# EAGLE design Z80 breakout board (EAGLE 5.06)
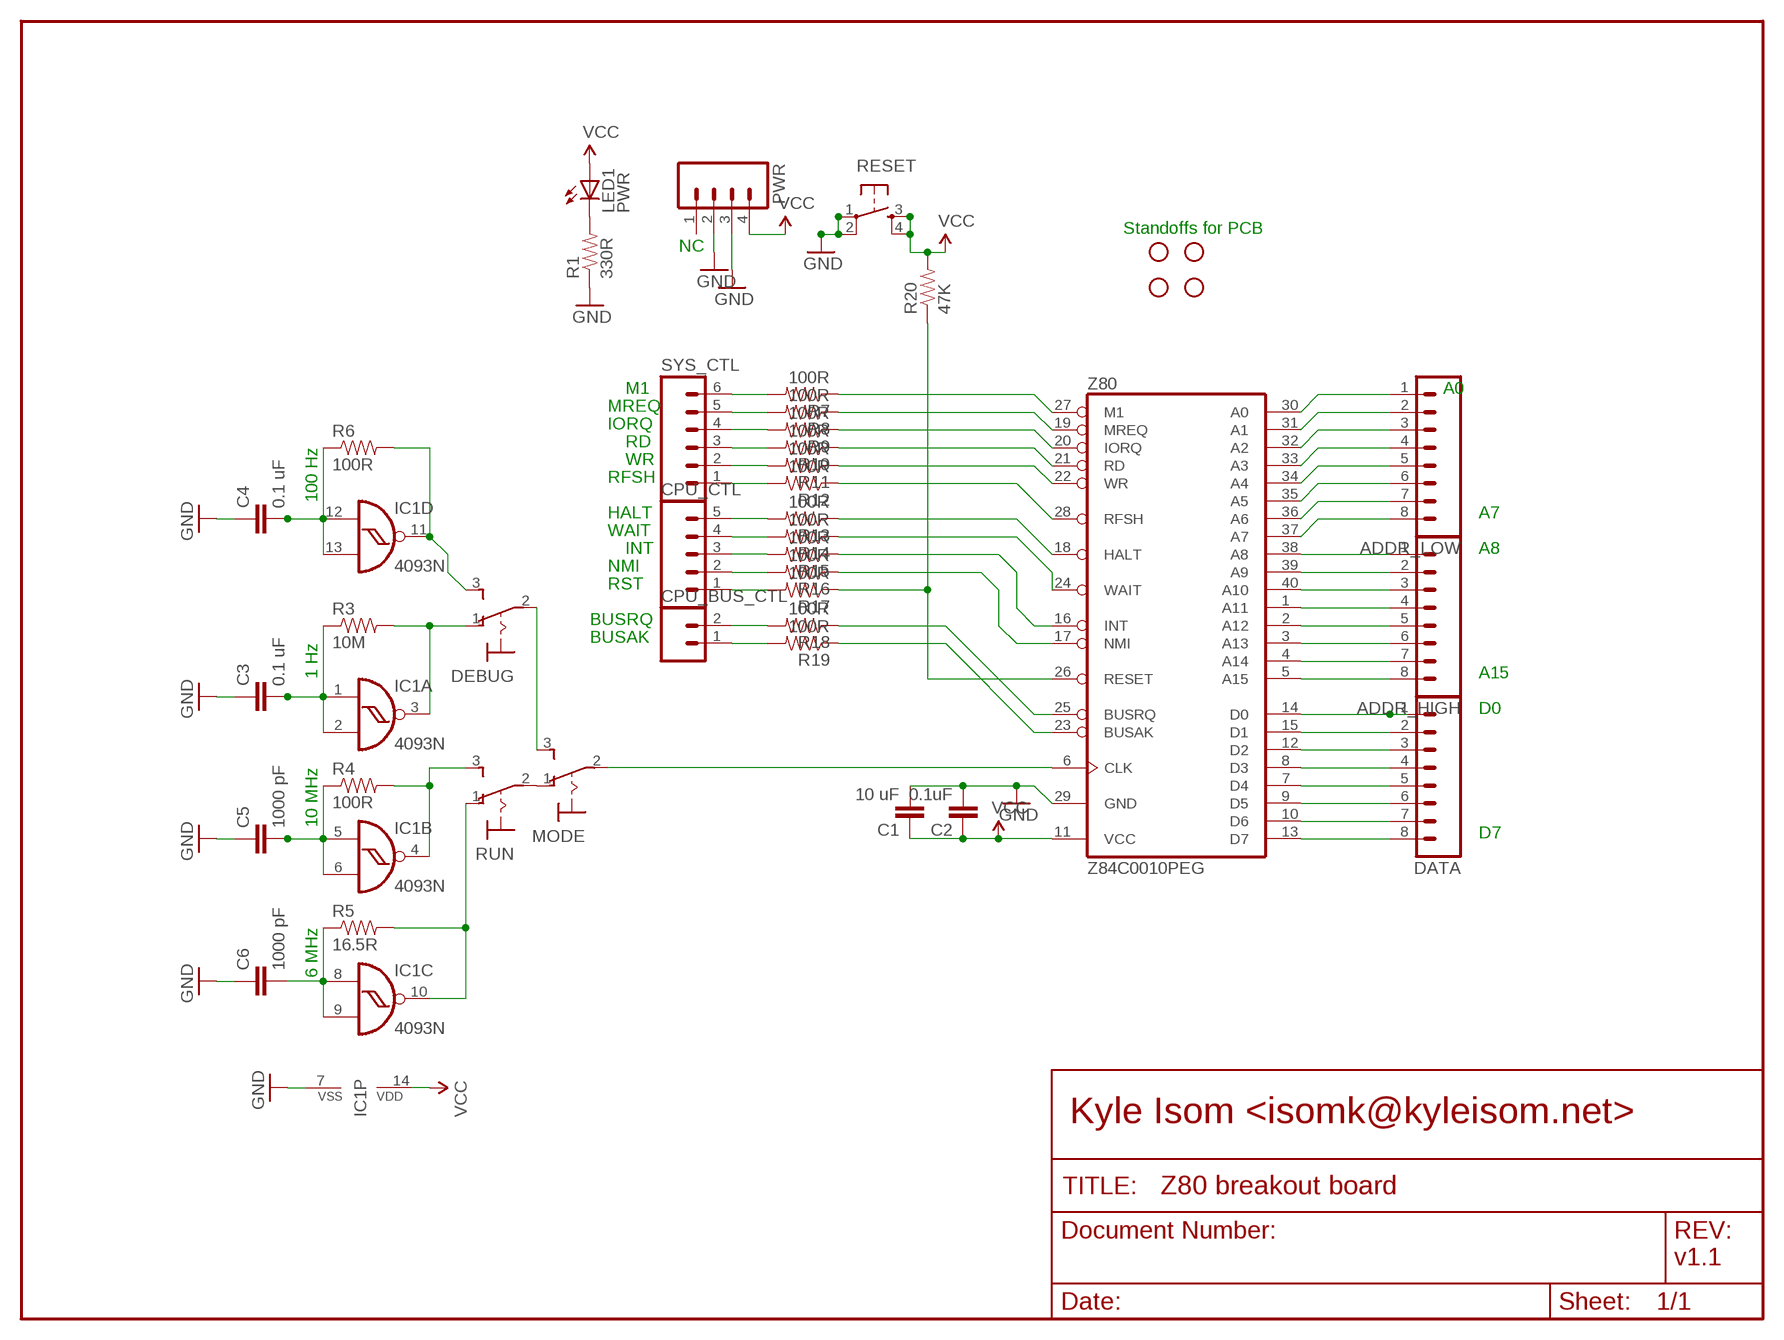
[diagram p0: schematic, sheet 1]

## Parts
ADDR_HIGH  M08  [1X08]
ADDR_LOW  M08  [1X08]
C1  10 uF  CAPPTH1  [CAP-PTH-5MM]
C2  0.1uF  CAPPTH1  [CAP-PTH-5MM]
C3  0.1 uF  CAPPTH1  [CAP-PTH-5MM]
C4  0.1 uF  CAPPTH1  [CAP-PTH-5MM]
C5  1000 pF  CAPPTH1  [CAP-PTH-5MM]
C6  1000 pF  CAPPTH1  [CAP-PTH-5MM]
CPU_BUS_CTL  M02LOCK  [1X02_LOCK]
CPU_CTL  M05LOCK  [1X05_LOCK]
DATA  M08  [1X08]
DEBUG  320-916  [320-916]
IC1  4093N  [DIL14]
JP1  STAND-OFF  [STAND-OFF]
JP2  STAND-OFF  [STAND-OFF]
JP3  STAND-OFF  [STAND-OFF]
JP4  STAND-OFF  [STAND-OFF]
LED1  PWR  LED5MM  [LED5MM]
MODE  320-916  [320-916]
PWR  M04POLAR  [MOLEX-1X4]
R1  330R  RESISTORPTH1  [AXIAL-0.3]
R3  10M  RESISTORPTH1  [AXIAL-0.3]
R4  100R  RESISTORPTH1  [AXIAL-0.3]
R5  16.5R  RESISTORPTH1  [AXIAL-0.3]
R6  100R  RESISTORPTH1  [AXIAL-0.3]
R7  100R  RESISTORPTH1  [AXIAL-0.3]
R8  100R  RESISTORPTH1  [AXIAL-0.3]
R9  100R  RESISTORPTH1  [AXIAL-0.3]
R10  100R  RESISTORPTH1  [AXIAL-0.3]
R11  100R  RESISTORPTH1  [AXIAL-0.3]
R12  100R  RESISTORPTH1  [AXIAL-0.3]
R13  100R  RESISTORPTH1  [AXIAL-0.3]
R14  100R  RESISTORPTH1  [AXIAL-0.3]
R15  100R  RESISTORPTH1  [AXIAL-0.3]
R16  100R  RESISTORPTH1  [AXIAL-0.3]
R17  100R  RESISTORPTH1  [AXIAL-0.3]
R18  100R  RESISTORPTH1  [AXIAL-0.3]
R19  100R  RESISTORPTH1  [AXIAL-0.3]
R20  47K  RESISTORPTH1  [AXIAL-0.3]
RESET  TAC_SWITCH12MM  [TACTILE-PTH-12MM]
RUN  320-916  [320-916]
SYS_CTL  M06LOCK  [1X06_LOCK]
Z80  Z84C0010PEG  Z80CPU  [DIL40]

## Nets
GND: C1.2 C2.2 C3.1 C4.1 C5.1 C6.1 IC1.7(P:VSS) PWR.2 PWR.3 R1.P$1 RESET.1 RESET.2 Z80.29(GND)
N$1: ADDR_LOW.1 Z80.30(A0)
N$2: ADDR_LOW.2 Z80.31(A1)
N$3: ADDR_LOW.3 Z80.32(A2)
N$4: ADDR_LOW.4 Z80.33(A3)
N$5: ADDR_LOW.5 Z80.34(A4)
N$6: ADDR_LOW.6 Z80.35(A5)
N$7: ADDR_LOW.7 Z80.36(A6)
N$8: ADDR_LOW.8 Z80.37(A7)
N$9: ADDR_HIGH.1 Z80.38(A8)
N$10: ADDR_HIGH.2 Z80.39(A9)
N$11: ADDR_HIGH.3 Z80.40(A10)
N$12: ADDR_HIGH.4 Z80.1(A11)
N$13: LED1.K(C) R1.P$2
N$14: ADDR_HIGH.5 Z80.2(A12)
N$15: ADDR_HIGH.6 Z80.3(A13)
N$16: ADDR_HIGH.7 Z80.4(A14)
N$17: ADDR_HIGH.8 Z80.5(A15)
N$18: DATA.1 Z80.14(D0)
N$19: DATA.2 Z80.15(D1)
N$20: DATA.3 Z80.12(D2)
N$21: DATA.4 Z80.8(D3)
N$22: DATA.5 Z80.7(D4)
N$23: DATA.6 Z80.9(D5)
N$24: DATA.7 Z80.10(D6)
N$25: DATA.8 Z80.13(D7)
N$26: R17.P$1 R20.P$1 Z80.26(RESET)
N$28: DEBUG.1(O) IC1.3(A:O) R3.P$2
N$29: C6.2 IC1.8(C:I0) IC1.9(C:I1) R5.P$1
N$30: C3.2 IC1.1(A:I0) IC1.2(A:I1) R3.P$1
N$31: C5.2 IC1.5(B:I0) IC1.6(B:I1) R4.P$1
N$32: IC1.4(B:O) R4.P$2 RUN.3(S)
N$33: MODE.2(P) Z80.6(CLK)
N$34: MODE.1(O) RUN.2(P)
N$35: IC1.10(C:O) R5.P$2 RUN.1(O)
N$36: DEBUG.2(P) MODE.3(S)
N$37: C4.2 IC1.12(D:I0) IC1.13(D:I1) R6.P$1
N$38: DEBUG.3(S) IC1.11(D:O) R6.P$2
N$39: R7.P$1 Z80.27(M1)
N$40: R8.P$1 Z80.19(MREQ)
N$41: R9.P$1 Z80.20(IORQ)
N$42: R10.P$1 Z80.21(RD)
N$43: R11.P$1 Z80.22(WR)
N$44: R12.P$1 Z80.28(RFSH)
N$45: R13.P$1 Z80.18(HALT)
N$46: R14.P$1 Z80.24(WAIT)
N$47: R15.P$1 Z80.16(INT)
N$48: R16.P$1 Z80.17(NMI)
N$49: R18.P$1 Z80.25(BUSRQ)
N$50: R19.P$1 Z80.23(BUSAK)
N$51: R7.P$2 SYS_CTL.6
N$52: R8.P$2 SYS_CTL.5
N$53: R9.P$2 SYS_CTL.4
N$54: R10.P$2 SYS_CTL.3
N$55: R11.P$2 SYS_CTL.2
N$56: R12.P$2 SYS_CTL.1
N$57: CPU_CTL.5 R13.P$2
N$58: CPU_CTL.4 R14.P$2
N$59: CPU_CTL.3 R15.P$2
N$60: CPU_CTL.2 R16.P$2
N$61: CPU_BUS_CTL.2 R18.P$2
N$62: CPU_BUS_CTL.1 R19.P$2
N$63: CPU_CTL.1 R17.P$2
VCC: C1.1 C2.1 IC1.14(P:VDD) LED1.A PWR.4 R20.P$2 RESET.3 RESET.4 Z80.11(VCC)
Unconnected: PWR.1

## Notes on the sheet
- Standoffs for PCB
- NC
- M1 | A0
- MREQ
- IORQ
- 100 Hz | RD
- WR
- RFSH
- HALT | A7
- WAIT
- INT | A8
- NMI
- RST
- BUSRQ
- 1 Hz | BUSAK
- A15
- D0
- 10 MHz
- D7
- 6 MHz
- Kyle Isom <isomk@kyleisom.net>
- v1.1

## Library data of the parts
ADDR_HIGH ADDR_LOW DATA = SparkFun:M08: Header 8 Standard 8-pin 0.1" header. Use with straight break away headers (SKU : PRT-00116), right angle break away headers (PRT-00553), swiss pins (PRT-00743), machine pins (PRT-00117), and female headers (PRT-00115).
C1-C6 = SparkFun:CAP: Capacitor Standard 0603 ceramic capacitor, and 0.1" leaded capacitor.
CPU_BUS_CTL = SparkFun:M02: Header 2 Standard 2-pin 0.1" header. Use with straight break away headers (SKU : PRT-00116), right angle break away headers (PRT-00553), swiss pins (PRT-00743), machine pins (PRT-00117), and female headers (PRT-00115). Molex polarized connector foot print use with SKU : PRT-08233 with associated crimp pins and housings.
CPU_CTL = SparkFun:M05: Header 5 Standard 5-pin 0.1" header. Use with straight break away headers (SKU : PRT-00116), right angle break away headers (PRT-00553), swiss pins (PRT-00743), machine pins (PRT-00117), and female headers (PRT-00115). Molex polarized connector foot print use with SKU : PRT-08230 with associated crimp pins and housings.
DEBUG MODE RUN = switch:320-916: TOGGLE SWITCH distributor RS Components
IC1 = 40xx:4093: Quad 2-input NAND schmitt trigger
JP1-JP4 = SparkFun:STAND-OFF: Stand Off This is the mechanical footprint for a #4 phillips button head screw. Use the keepout ring to avoid running the screw head into surrounding components. SKU : PRT-00447
LED1 = led:LED: LED OSRAM: - CHIPLED LG R971, LG N971, LY N971, LG Q971, LY Q971, LO R971, LY R971 LH N974, LH R974 LS Q976, LO Q976, LY Q976 LO Q996 - Hyper CHIPLED LW Q18S LB Q993, LB Q99A, LB R99A - SideLED LS A670, LO A670, LY A670, LG A670, LP A670 LB A673, LV A673, LT A673, LW A673 LH A674 LY A675 LS A676, LA A676, LO A676, LY A676, LW A676 LS A679, LY A679, LG A679 - Hyper Micro SIDELED® LS Y876, LA Y876, LO Y876, LY Y876 LT Y87S - SmartLED LW L88C, LW L88S LB L89C, LB L89S, LG L890 LS L89K, LO L89K, LY L89K LS L896, LA L896, LO L896, LY L896 - TOPLED LS T670, LO T670, LY T670, LG T670, LP T670 LSG T670, LSP T670, LSY T670, LOP T670, LYG T670 LG T671, LOG T671, LSG T671 LB T673, LV T673, LT T673, LW T673 LH T674 LS T676, LA T676, LO T676, LY T676, LB T676, LH T676, LSB T676, LW T676 LB T67C, LV T67C, LT T67C, LS T67K, LO T67K, LY T67K, LW E67C LS E67B, LA E67B, LO E67B, LY E67B, LB E67C, LV E67C, LT E67C LW T67C LS T679, LY T679, LG T679 LS T770, LO T770, LY T770, LG T770, LP T770 LB T773, LV T773, LT T773, LW T773 LH T774 LS E675, LA E675, LY E675, LS T675 LS T776, LA T776, LO T776, LY T776, LB T776 LHGB T686 LT T68C, LB T68C - Hyper Mini TOPLED® LB M676 - Mini TOPLED Santana® LG M470 LS M47K, LO M47K, LY M47K Source: http://www.osram.convergy.de LUXEON: - LUMILED® LXK2-PW12-R00, LXK2-PW12-S00, LXK2-PW14-U00, LXK2-PW14-V00 LXK2-PM12-R00, LXK2-PM12-S00, LXK2-PM14-U00 LXK2-PE12-Q00, LXK2-PE12-R00, LXK2-PE12-S00, LXK2-PE14-T00, LXK2-PE14-U00 LXK2-PB12-K00, LXK2-PB12-L00, LXK2-PB12-M00, LXK2-PB14-N00, LXK2-PB14-P00, LXK2-PB14-Q00 LXK2-PR12-L00, LXK2-PR12-M00, LXK2-PR14-Q00, LXK2-PR14-R00 LXK2-PD12-Q00, LXK2-PD12-R00, LXK2-PD12-S00 LXK2-PH12-R00, LXK2-PH12-S00 LXK2-PL12-P00, LXK2-PL12-Q00, LXK2-PL12-R00 Source: www.luxeon.com KINGBRIGHT: KA-3528ASYC Source: www.kingbright.com
PWR = SparkFun:M04: Header 4 Standard 4-pin 0.1" header. Use with straight break away headers (SKU : PRT-00116), right angle break away headers (PRT-00553), swiss pins (PRT-00743), machine pins (PRT-00117), and female headers (PRT-00115). Molex polarized connector foot print use with SKU : PRT-08231 with associated crimp pins and housings.
R1 R3-R20 = SparkFun:RESISTOR: Resistor Basic schematic elements and footprints for 0603, 1206, and PTH 1/10th watt (small) resistors.
RESET = SparkFun:TAC_SWITCH: Momentary Switch Button commonly used for reset or general input. Spark Fun Electronics SKU : COM-00097
SYS_CTL = SparkFun:M06: Header 6 Standard 6-pin 0.1" header. Use with straight break away headers (SKU : PRT-00116), right angle break away headers (PRT-00553), swiss pins (PRT-00743), machine pins (PRT-00117), and female headers (PRT-00115). Molex polarized connector foot print use with SKU : PRT-08094 with associated crimp pins and housings. NOTES ON THE VARIANTS LOCK and LOCK_LONGPADS... This footprint was designed to help hold the alignment of a through-hole component (i.e. 6-pin header) while soldering it into place. You may notice that each hole has been shifted either up or down by 0.005 of an inch from it's more standard position (which is a perfectly straight line). This slight alteration caused the pins (the squares in the middle) to touch the edges of the holes. Because they are alternating, it causes a "brace" to hold the component in place. 0.005 has proven to be the perfect amount of "off-center" position when using our standard breakaway headers. Although looks a little odd when you look at the bare footprint, once you have a header in there, the alteration is very hard to notice. Also, if you push a header all the way into place, it is covered up entirely on the bottom side. This idea of altering the position of holes to aid alignment will be further integrated into the Sparkfun Library for other footprints. It can help hold any component with 3 or more connection pins.
Z80 = zilog:Z80CPU: Z80 FAMILY DEVICE

## Board
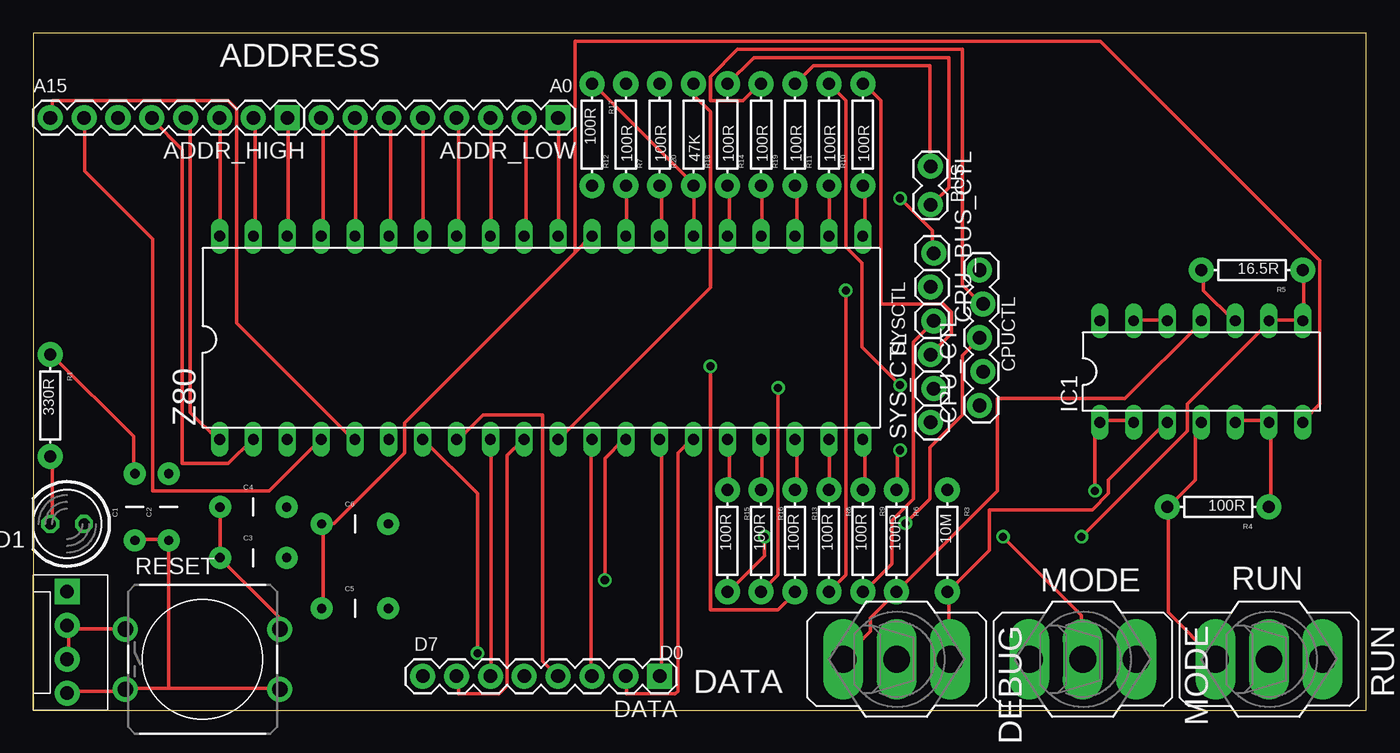
[diagram p1: board, top side]
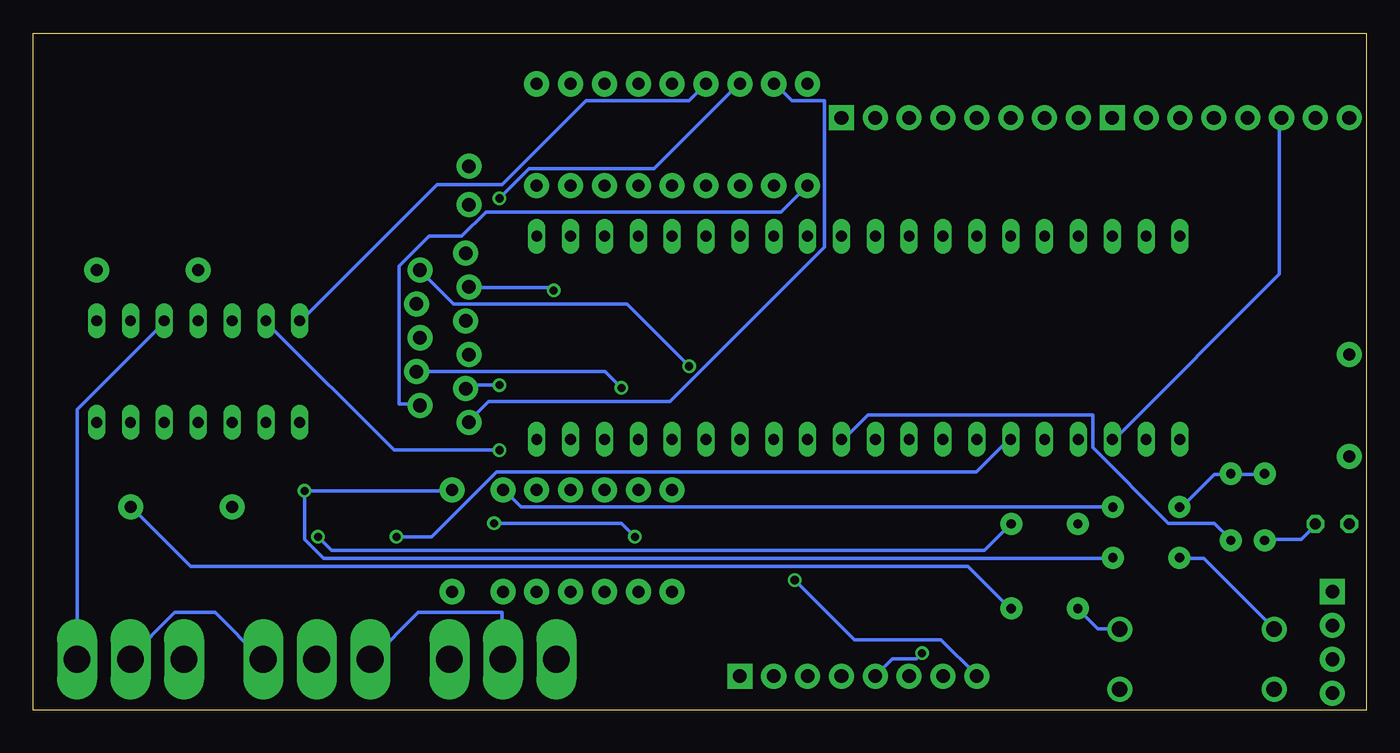
[diagram p2: board, bottom side, seen from below]

Size 100 x 50.79 mm. Coordinates in mm from the lower left corner, seen from the top.
Outline: 0,0 100,0 100,50.79 0,50.79 0,0
Copper layers (1*16): Top 0.035mm / dielectric 1.5mm / Bottom 0.035mm
Design rules "default": minimum track width 10mil, minimum drill 24mil, track to track 8mil, track to pad 8mil, pad to pad 8mil, via to via 8mil, smd to smd 8mil, copper to edge 40mil, drill to drill 8mil, minimum pad ring 10mil, minimum via ring 8mil, stop-mask expansion 4mil, vias tented up to drill 0mil, thermal gap 10mil

### Footprints (pad centres in the part's own frame; a part is rotated, then mirrored left to right if it is on the bottom)
1X08 = drill 1.016 pad 1.88 square: 1 0,0 | drill 1.016 pad 1.88 round: 2 2.54,0; 3 5.08,0; 4 7.62,0; 5 10.16,0; 6 12.7,0; 7 15.24,0; 8 17.78,0
CAP-PTH-5MM = drill 0.7 pad 1.651 round: 1 -2.5,0; 2 2.5,0
1X02_LOCK = drill 1.016 pad 1.88 round: 1 -0.178,0; 2 2.718,0
1X05_LOCK = drill 1.016 pad 1.88 round: 1 0,0.127; 2 2.54,-0.127; 3 5.08,0.127; 4 7.62,-0.127; 5 10.16,0.127
320-916 = drill 2.007 long: 1 0,4.013; 2 0,0; 3 0,-4.013
DIL14 = drill 0.813 long: 1 -7.62,-3.81; 2 -5.08,-3.81; 3 -2.54,-3.81; 4 0,-3.81; 5 2.54,-3.81; 6 5.08,-3.81; 7 7.62,-3.81; 8 7.62,3.81; 9 5.08,3.81; 10 2.54,3.81; 11 0,3.81; 12 -2.54,3.81; 13 -5.08,3.81; 14 -7.62,3.81
STAND-OFF = hole 3.302: 0,0
LED5MM = drill 0.813 octagon: A -1.27,0; K 1.27,0
MOLEX-1X4 = drill 1.016 pad 1.88 square: 1 0,0 | drill 1.016 pad 1.88 round: 2 2.54,0; 3 5.08,0; 4 7.62,0
AXIAL-0.3 = drill 0.9 pad 1.88 round: P$1 -3.81,0; P$2 3.81,0
TACTILE-PTH-12MM = drill 1.143 pad 1.88 round: 1 -5.791,2.261; 2 5.791,2.261; 3 -5.791,-2.261; 4 5.791,-2.261
1X06_LOCK = drill 1.016 pad 1.88 round: 1 0,0; 2 2.54,-0.254; 3 5.08,0; 4 7.62,-0.254; 5 10.16,0; 6 12.7,-0.254
DIL40 = drill 0.813 long: 1 -24.13,-7.62; 2 -21.59,-7.62; 3 -19.05,-7.62; 4 -16.51,-7.62; 5 -13.97,-7.62; 6 -11.43,-7.62; 7 -8.89,-7.62; 8 -6.35,-7.62; 9 -3.81,-7.62; 10 -1.27,-7.62; 11 1.27,-7.62; 12 3.81,-7.62; 13 6.35,-7.62; 14 8.89,-7.62; 15 11.43,-7.62; 16 13.97,-7.62; 17 16.51,-7.62; 18 19.05,-7.62; 19 21.59,-7.62; 20 24.13,-7.62; 21 24.13,7.62; 22 21.59,7.62; 23 19.05,7.62; 24 16.51,7.62; 25 13.97,7.62; 26 11.43,7.62; 27 8.89,7.62; 28 6.35,7.62; 29 3.81,7.62; 30 1.27,7.62; 31 -1.27,7.62; 32 -3.81,7.62; 33 -6.35,7.62; 34 -8.89,7.62; 35 -11.43,7.62; 36 -13.97,7.62; 37 -16.51,7.62; 38 -19.05,7.62; 39 -21.59,7.62; 40 -24.13,7.62

### Placement (x,y rotation side)
ADDR_HIGH  19.05,44.45 180 top
ADDR_LOW  39.37,44.45 180 top
C1  7.62,15.24 90 top
C2  10.16,15.24 90 top
C3  16.51,11.43 0 top
C4  16.51,15.24 0 top
C5  24.13,7.62 0 top
C6  24.13,13.97 0 top
CPU_BUS_CTL  67.31,40.64 270 top
CPU_CTL  71.12,22.86 90 top
DATA  46.99,2.54 180 top
DEBUG  64.77,3.81 270 top
IC1  87.63,25.4 0 top
JP1  -60.96,40.64 0 top  (outside the outline)
JP2  -67.31,40.64 0 top  (outside the outline)
JP3  -16.51,52.07 0 top  (outside the outline)
JP4  -22.86,52.07 0 top  (outside the outline)
LED1  2.54,13.97 180 top
MODE  78.74,3.81 270 top
PWR  2.54,8.89 270 top
R1  1.27,22.86 270 top
R3  68.58,12.7 270 top
R4  88.9,15.24 180 top
R5  91.44,33.02 180 top
R6  64.77,12.7 270 top
R7  46.99,43.18 90 top
R8  59.69,12.7 270 top
R9  62.23,12.7 270 top
R10  62.23,43.18 90 top
R11  59.69,43.18 90 top
R12  44.45,43.18 90 top
R13  57.15,12.7 270 top
R14  54.61,43.18 90 top
R15  52.07,12.7 270 top
R16  54.61,12.7 270 top
R17  41.91,43.18 270 top
R18  52.07,43.18 90 top
R19  57.15,43.18 90 top
R20  49.53,43.18 90 top
RESET  12.7,3.81 0 top
RUN  92.71,3.81 270 top
SYS_CTL  67.31,21.59 90 top
Z80  38.1,27.94 0 top

### Tracks (layer width: path | path; a pad name or v marks a point on that pad's centre or on a via)
GND
  Top 0.254: 2.64,6.1 2.64,6.3 PWR.2 2.64,6.1 | 2.64,6.1 2.64,3.86 PWR.3 | 2.64,6.1 6.91,6.1 RESET.1 | C4.1 14.02,15.24 14.02,11.58 C3.1 14.02,11.38 18.49,6.91 RESET.2 | R1.P$1 1.42,26.62 7.52,20.52 7.52,17.88 C1.2 | 40.64,34.34 27.84,21.54 27.84,19.3 22.55,14.02 21.74,14.02 C6.1 21.74,13.82 21.74,7.72 C5.1 | 40.64,34.34 41.86,35.56 Z80.29 | 40.64,34.34 40.64,50.19 80.06,50.19 96.52,33.73 96.52,22.96 95.3,21.74 IC1.7
  Bottom 0.254: 10.16,17.68 7.72,17.68 C1.2 | 10.16,17.68 11.38,17.68 13.82,15.24 C4.1 | 10.16,17.68 C2.2 | RESET.1 6.91,6.1 12.19,11.38 13.82,11.38 C3.1 | C5.1 21.54,7.52 20.12,6.1 18.49,6.1 RESET.2
N$1
  Top 0.254: Z80.30 39.42,35.56 39.42,44.3 ADDR_LOW.1
N$2
  Top 0.254: Z80.31 36.98,35.56 36.98,44.3 ADDR_LOW.2
N$3
  Top 0.254: Z80.32 34.34,35.56 34.34,44.3 ADDR_LOW.3
N$4
  Top 0.254: Z80.33 31.9,35.56 31.9,44.3 ADDR_LOW.4
N$5
  Top 0.254: Z80.34 29.26,35.56 29.26,44.3 ADDR_LOW.5
N$6
  Top 0.254: Z80.35 26.82,35.56 26.82,44.3 ADDR_LOW.6
N$7
  Top 0.254: Z80.36 24.18,35.56 24.18,44.3 ADDR_LOW.7
N$8
  Top 0.254: Z80.37 21.74,35.56 21.74,44.3 ADDR_LOW.8
N$9
  Top 0.254: Z80.38 19.1,35.56 19.1,44.3 ADDR_HIGH.1
N$10
  Top 0.254: Z80.39 16.66,35.56 16.66,44.3 ADDR_HIGH.2
N$11
  Top 0.254: Z80.40 14.02,35.56 14.02,44.3 ADDR_HIGH.3
N$12
  Top 0.254: Z80.1 13.82,20.32 11.79,22.35 11.79,44.09 ADDR_HIGH.4
N$13
  Top 0.254: LED1.K 1.42,14.02 1.42,18.9 R1.P$2
N$14
  Top 0.254: Z80.2 16.46,20.32 14.63,18.49 11.18,18.49 11.18,42.06 8.94,44.3 ADDR_HIGH.5
N$15
  Bottom 0.254: Z80.3 18.9,20.32 6.5,32.72 6.5,44.3 ADDR_HIGH.6
N$16
  Top 0.254: Z80.4 21.54,20.32 17.68,16.46 8.94,16.46 8.94,35.36 3.86,40.44 3.86,44.3 ADDR_HIGH.7
N$17
  Top 0.254: Z80.5 23.98,20.32 15.24,29.06 15.24,45.11 14.63,45.72 1.42,45.72 1.42,44.5 ADDR_HIGH.8
N$18
  Top 0.254: Z80.14 47.14,20.32 47.14,2.64 DATA.1
N$19
  Top 0.254: Z80.15 49.38,20.32 48.36,19.3 48.36,1.42 48.16,1.22 44.5,1.22 44.5,2.44 DATA.2
N$20
  Top 0.254: Z80.12 41.86,20.32 41.86,2.64 DATA.3
N$21
  Top 0.254: Z80.8 31.9,20.32 33.73,22.15 38.2,22.15 38.2,3.66 39.22,2.64 DATA.4
N$22  (via drill 0.61)
  Top 0.254: v33.33,4.27 33.33,16.26 29.26,20.32 Z80.7
  Bottom 0.254: v33.33,4.27 33.73,3.86 35.56,3.86 36.78,2.64 DATA.5
N$23
  Top 0.254: Z80.9 34.34,20.32 34.34,2.64 DATA.6
N$24
  Top 0.254: Z80.10 36.78,20.32 35.56,19.1 35.56,1.83 34.95,1.22 31.9,1.22 31.9,2.44 DATA.7
N$25  (via drill 0.61)
  Top 0.254: v42.88,9.75 42.88,18.9 44.3,20.32 Z80.13
  Bottom 0.254: v42.88,9.75 38.41,5.28 31.9,5.28 29.26,2.64 DATA.8
N$26
  Top 0.254: Z80.26 49.58,35.56 49.58,39.22 R20.P$1 49.38,39.42 49.38,39.62 42.06,46.94 R17.P$1
N$28
  Top 0.254: IC1.3 84.94,21.54 80.67,17.27 80.67,16.26 79.45,15.04 71.73,15.04 71.73,11.99 68.68,8.94 R3.P$2 68.68,8.74 68.68,3.86 DEBUG.1
N$29  (via drill 0.61)
  Top 0.254: v78.64,13.01 86.56,20.93 86.56,22.96 92.66,29.06 IC1.9 92.86,29.26 95.1,29.26 IC1.8 95.3,29.26 95.3,32.92 R5.P$1
  Bottom 0.254: v78.64,13.01 77.62,11.99 28.65,11.99 26.82,13.82 C6.2
N$30  (via drill 0.61)
  Top 0.254: IC1.2 82.5,21.74 80.06,21.74 IC1.1 79.86,21.54 79.65,21.34 v79.65,16.46
  Bottom 0.254: C3.2 19.1,11.38 78.23,11.38 79.65,12.8 v79.65,16.46 68.68,16.46 R3.P$1
N$31
  Top 0.254: IC1.5 90.22,21.74 92.66,21.74 IC1.6 92.86,21.54 92.86,15.24 R4.P$1
  Bottom 0.254: C5.2 26.82,7.72 29.87,10.77 88.19,10.77 92.66,15.24 R4.P$1
N$32
  Top 0.254: 85.14,15.24 87.17,17.27 87.17,21.13 IC1.4 | 85.14,15.24 85.14,7.32 88.59,3.86 RUN.3 | 85.14,15.24 R4.P$2
N$33  (via drill 0.61)
  Top 0.254: v72.75,13.01 78.64,7.11 78.64,3.86 MODE.2
  Bottom 0.254: v72.75,13.01 70.1,13.01 65.23,17.88 29.26,17.88 26.82,20.32 Z80.6
N$34
  Bottom 0.254: MODE.1 82.91,3.86 86.36,7.32 89.41,7.32 92.86,3.86 RUN.2
N$35
  Top 0.254: IC1.10 90.02,29.26 87.78,31.5 87.78,32.92 R5.P$2
  Bottom 0.254: IC1.10 90.22,29.06 96.72,22.55 RUN.1
N$36
  Bottom 0.254: DEBUG.2 64.82,3.86 64.82,7.32 71.12,7.32 74.57,3.86 MODE.3
N$37  (via drill 0.61)
  Top 0.254: IC1.13 82.7,29.26 84.94,29.26 IC1.12 | v65.02,19.51 64.82,19.3 64.82,16.66 R6.P$1
  Bottom 0.254: C4.2 63.4,15.24 64.62,16.46 R6.P$1 | v65.02,19.51 72.95,19.51 82.5,29.06 IC1.13
N$38
  Top 0.254: IC1.11 87.58,29.06 81.89,23.37 72.34,23.37 72.34,16.46 R6.P$2 62.79,6.91 62.79,5.89 60.76,3.86 DEBUG.3
N$39
  Top 0.254: Z80.27 47.14,35.56 47.14,39.22 R7.P$1
N$40
  Top 0.254: Z80.19 59.74,20.32 59.74,16.66 R8.P$1
N$41
  Top 0.254: Z80.20 62.38,20.32 62.38,16.66 R9.P$1
N$42
  Top 0.254: Z80.21 62.38,35.56 62.38,39.22 R10.P$1
N$43
  Top 0.254: Z80.22 59.74,35.56 59.74,39.22 R11.P$1
N$44
  Top 0.254: Z80.28 44.5,35.56 44.5,39.22 R12.P$1
N$45
  Top 0.254: Z80.18 57.3,20.32 57.3,16.66 R13.P$1
N$46
  Top 0.254: Z80.24 54.66,35.56 54.66,39.22 R14.P$1
N$47
  Top 0.254: Z80.16 52.22,20.32 52.22,16.66 R15.P$1
N$48
  Top 0.254: Z80.17 54.66,20.32 54.66,16.66 R16.P$1
N$49
  Top 0.254: Z80.25 52.22,35.56 52.22,39.22 R18.P$1
N$50
  Top 0.254: Z80.23 57.3,35.56 57.3,39.22 R19.P$1
N$51  (via drill 0.61)
  Top 0.254: v65.02,38.41 67.46,35.97 67.46,34.34 SYS_CTL.6
  Bottom 0.254: v65.02,38.41 62.79,40.64 53.44,40.64 47.14,46.94 R7.P$2
N$52  (via drill 0.61)
  Top 0.254: v60.96,31.5 60.96,10.16 R8.P$2
  Bottom 0.254: v60.96,31.5 61.16,31.7 67.26,31.7 SYS_CTL.5
N$53
  Top 0.254: R9.P$2 62.38,8.94 64.41,10.97 64.41,14.22 66.04,15.85 66.04,27.64 67.46,29.06 SYS_CTL.4
N$54
  Top 0.254: SYS_CTL.3 68.89,28.25 68.89,29.87 68.28,30.48 63.6,30.48 63.6,45.72 62.38,46.94 R10.P$2
N$55  (via drill 0.61)
  Top 0.254: v65.02,24.38 62.18,27.23 62.18,33.53 60.96,34.75 60.96,45.72 R11.P$2
  Bottom 0.254: v65.02,24.38 67.26,24.38 67.46,24.18 SYS_CTL.2
N$56
  Bottom 0.254: SYS_CTL.1 67.26,21.74 65.84,23.16 52.22,23.16 40.64,34.75 40.64,45.72 43.08,45.72 44.3,46.94 R12.P$2
N$57  (via drill 0.61)
  Top 0.254: v50.8,25.81 50.8,7.52 55.88,7.52 57.1,8.74 R13.P$2
  Bottom 0.254: v50.8,25.81 55.47,30.48 68.48,30.48 70.92,32.92 CPU_CTL.5
N$58
  Top 0.254: R14.P$2 54.46,46.94 53.24,45.72 50.8,45.72 50.8,47.55 52.83,49.58 69.7,49.58 69.7,31.9 71.12,30.48 CPU_CTL.4
N$59  (via drill 0.61)
  Top 0.254: v54.86,13.01 54.86,11.58 52.22,8.94 R15.P$2 | v65.43,14.02 67.26,15.85 67.26,19.71 69.7,22.15 69.7,26.62 70.92,27.84 CPU_CTL.3
  Bottom 0.254: v54.86,13.01 55.88,14.02 v65.43,14.02
N$60  (via drill 0.61)
  Top 0.254: v55.88,24.18 55.88,10.16 R16.P$2
  Bottom 0.254: v55.88,24.18 57.1,25.4 CPU_CTL.2
N$61
  Top 0.254: R18.P$2 54.05,48.97 68.68,48.97 68.68,39.22 67.46,38 CPU_BUS_CTL.2
N$62
  Top 0.254: R19.P$2 58.52,48.36 67.26,48.36 67.26,40.84 CPU_BUS_CTL.1
N$63
  Bottom 0.254: R17.P$2 43.89,37.39 66.04,37.39 67.87,35.56 70.31,35.56 72.54,33.33 72.54,22.96 71.12,22.96 CPU_CTL.1
VCC
  Top 0.254: C1.1 7.72,12.8 10.16,12.8 C2.1 10.16,1.63 | PWR.4 2.64,1.42 6.91,1.42 RESET.3 6.91,1.63 10.16,1.63 | 10.16,1.63 18.49,1.63 RESET.4 | Z80.11 39.42,20.32 50.8,31.7 50.8,44.91 49.58,46.13 49.58,46.94 R20.P$2
  Bottom 0.254: LED1.A 3.86,13.82 4.88,12.8 7.52,12.8 C1.1 | IC1.14 79.86,29.26 69.7,39.42 64.82,39.42 58.52,45.72 50.8,45.72 R20.P$2 | C2.1 10.16,12.8 11.38,14.02 14.83,14.02 20.52,19.71 20.52,22.15 37.39,22.15 39.22,20.32 Z80.11

### Text on the board
tPlace: ADDRESS | A15 | A0 | BUS | SYSCTL | CPUCTL | RUN | MODE | D7 | D0 | DATA